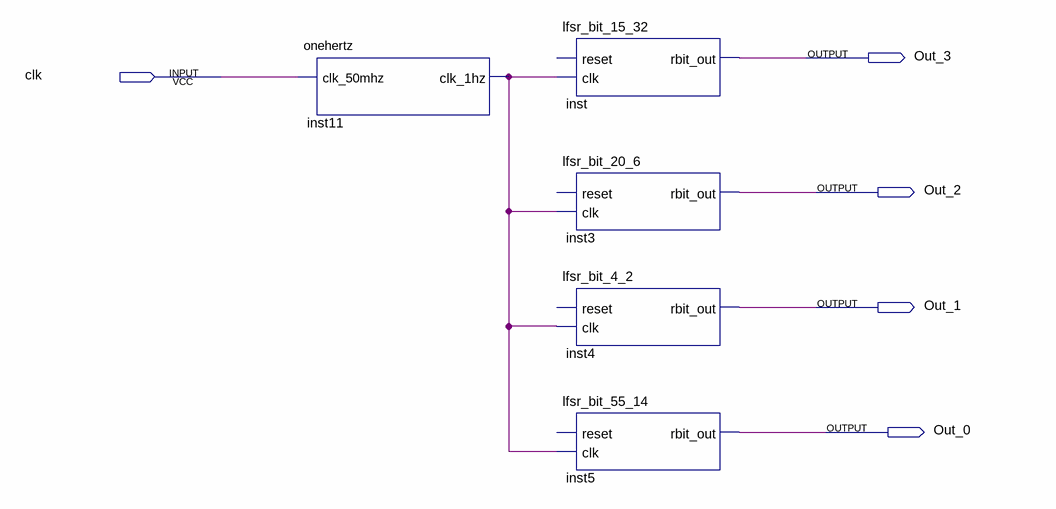
[diagram p0: schematic sheet]
// Quartus schematic rand_4bit_works.bdf as structural Verilog: 5 symbols, 5 pins
module rand_4bit_works (
  input  clk,
  output Out_3,
  output Out_2,
  output Out_1,
  output Out_0
);

  wire inst11_clk_1hz;

  onehertz inst11 (.clk_50mhz(clk), .clk_1hz(inst11_clk_1hz));
  lfsr_bit_15_32 inst (.clk(inst11_clk_1hz), .rbit_out(Out_3));  // open: reset
  lfsr_bit_20_6 inst3 (.clk(inst11_clk_1hz), .rbit_out(Out_2));  // open: reset
  lfsr_bit_4_2 inst4 (.clk(inst11_clk_1hz), .rbit_out(Out_1));  // open: reset
  lfsr_bit_55_14 inst5 (.clk(inst11_clk_1hz), .rbit_out(Out_0));  // open: reset
endmodule
